# EAGLE design PR8002 (EAGLE 6.6.0)
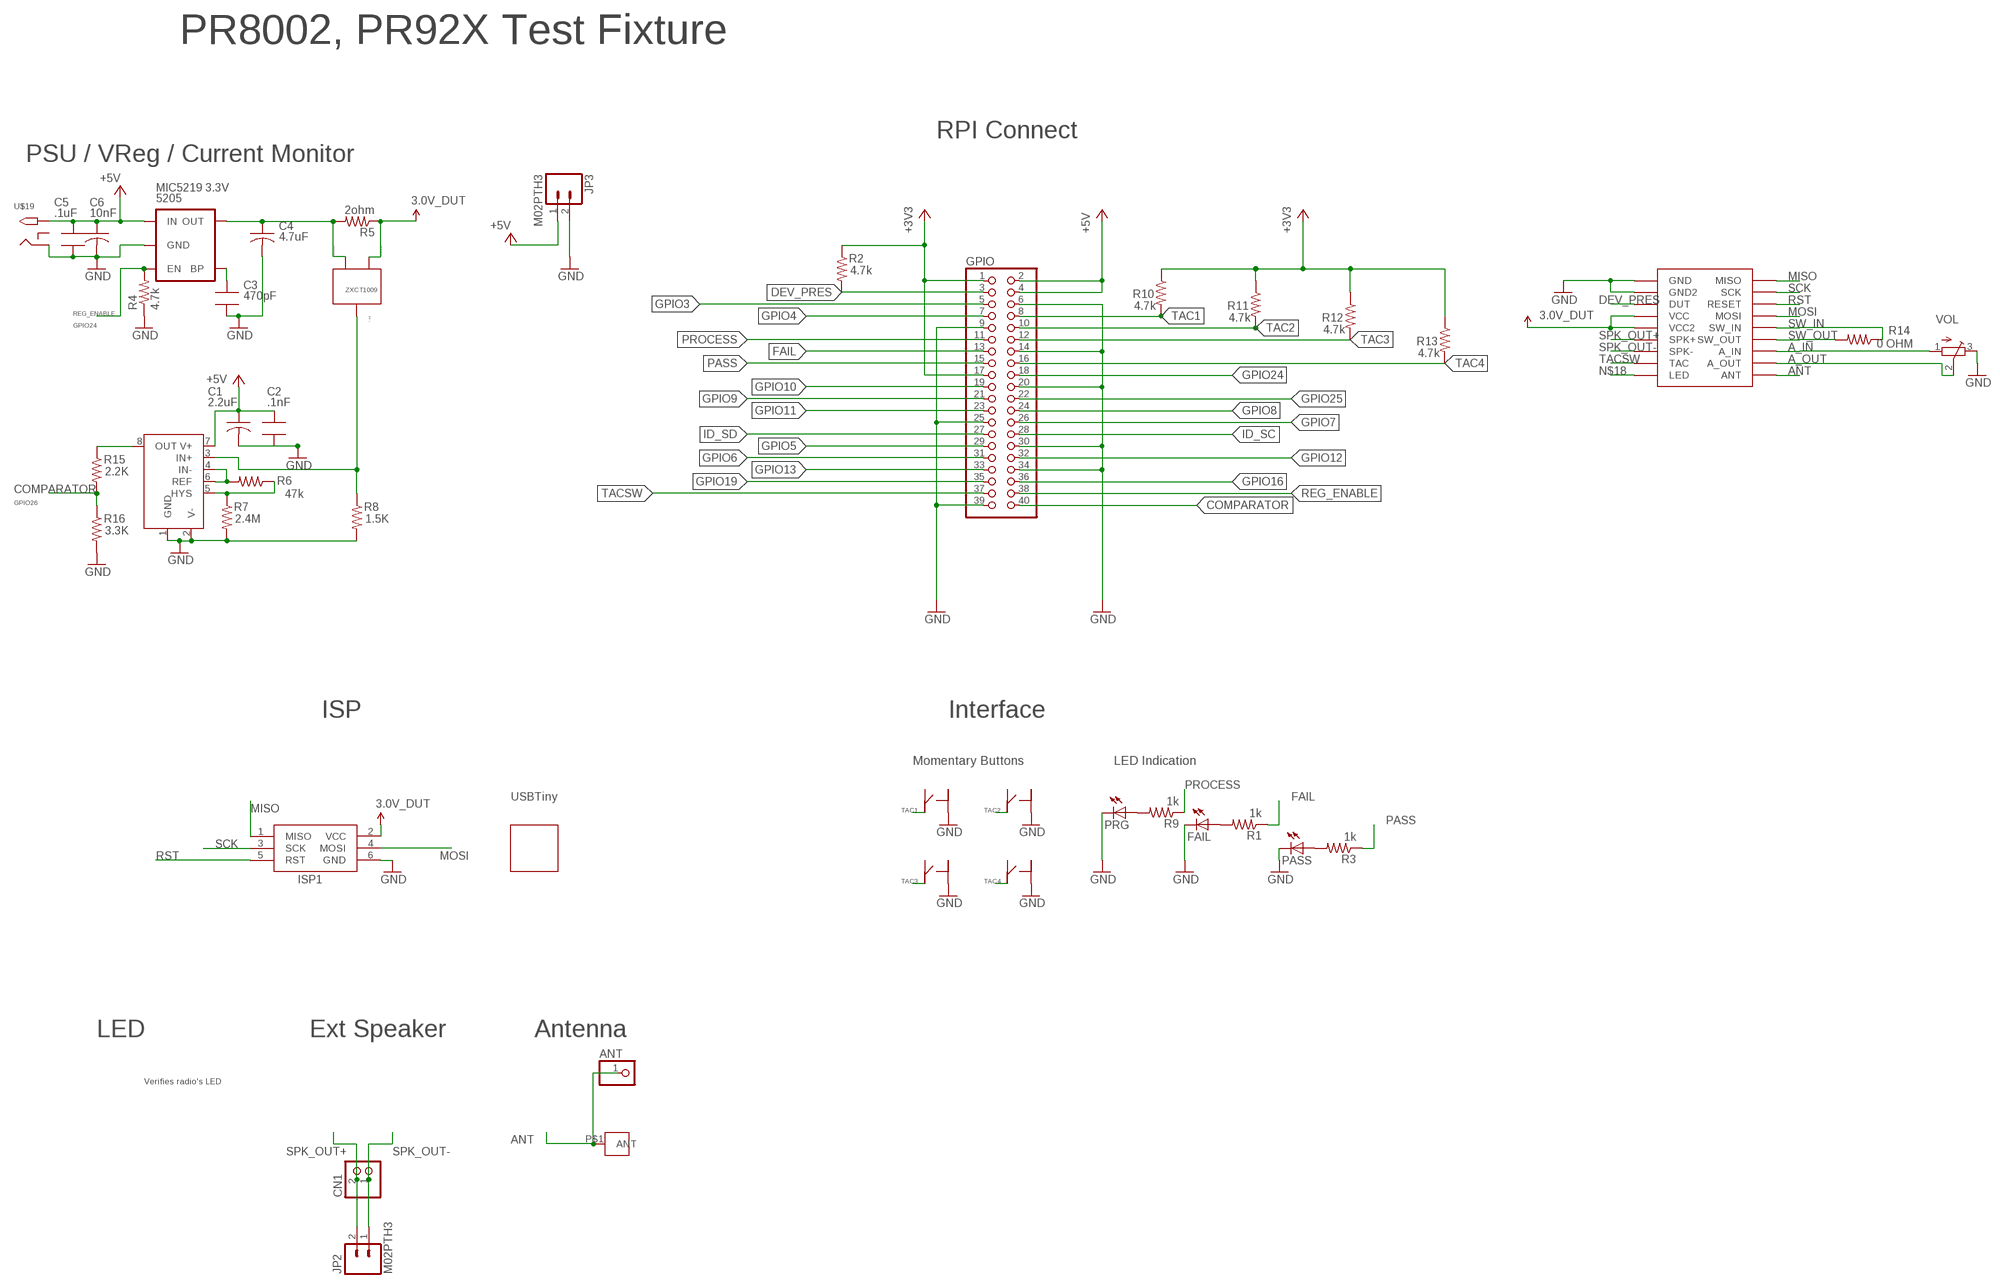
[diagram p0: schematic, sheet 1]

## Parts
5205  MIC5219 3.3V  V_REG_MIC52193.3V  [SOT23-5]
ANT  PINHD-1X1  [1X01]
C1  2.2uF  C-USC0805  [C0805]
C2  .1nF  C_SMT_0805_ADAFRUIT  [0805_ADAFRUIT]
C3  470pF  C_SMT_0805_ADAFRUIT  [0805_ADAFRUIT]
C4  4.7uF  C-USC0805  [C0805]
C5  .1uF  C_SMT_0805_ADAFRUIT  [0805_ADAFRUIT]
C6  10nF  C-USC0805  [C0805]
CN1  JST_2PIN-SMT-RA  [JST-B2B-PH-SM4-TB]
FAIL  LEDCHIP-LED0805  [CHIP-LED0805]
GPIO  PINHD-2X20  [2X20]
ISP1  AVRISP-6  [AVRISP]
J1  M3_SCREW_POST  [M3_BOLT_HOLE]
JP2  M02PTH3  [1X02_LONGPADS]
JP3  M02PTH3  [1X02_LONGPADS]
PASS  LEDCHIP-LED0805  [CHIP-LED0805]
PRG  LEDCHIP-LED0805  [CHIP-LED0805]
R1  1k  R_SMT_0805_ADAFRUIT  [0805_ADAFRUIT]
R2  4.7k  R_SMT_0805_ADAFRUIT  [0805_ADAFRUIT]
R3  1k  R_SMT_0805_ADAFRUIT  [0805_ADAFRUIT]
R4  4.7k  R_SMT_0805_ADAFRUIT  [0805_ADAFRUIT]
R5  2ohm  R_SMT_0805_ADAFRUIT  [0805_ADAFRUIT]
R6  47k  R_SMT_0805_ADAFRUIT  [0805_ADAFRUIT]
R7  2.4M  R_SMT_0805_ADAFRUIT  [0805_ADAFRUIT]
R8  1.5K  R_SMT_0805_ADAFRUIT  [0805_ADAFRUIT]
R9  1k  R_SMT_0805_ADAFRUIT  [0805_ADAFRUIT]
R10  4.7k  R_SMT_0805_ADAFRUIT  [0805_ADAFRUIT]
R11  4.7k  R_SMT_0805_ADAFRUIT  [0805_ADAFRUIT]
R12  4.7k  R_SMT_0805_ADAFRUIT  [0805_ADAFRUIT]
R13  4.7k  R_SMT_0805_ADAFRUIT  [0805_ADAFRUIT]
R14  0 OHM  R_SMT_0805_ADAFRUIT  [0805_ADAFRUIT]
R15  2.2K  R_SMT_0805_ADAFRUIT  [0805_ADAFRUIT]
R16  3.3K  R_SMT_0805_ADAFRUIT  [0805_ADAFRUIT]
TSM931  TSM931  [MSOP8]
U$19  2.1MMJACKTHM  [PJ-102A]
U$20  C&K_PTS645  [C&K_PTS645_SMT]
U$22  C&K_PTS645  [C&K_PTS645_SMT]
U$23  C&K_PTS645  [C&K_PTS645_SMT]
U$24  C&K_PTS645  [C&K_PTS645_SMT]
U$25  SFUN_POCKETPROGRAMMER  [SFUN_POCKETPROGRAMMER]
U$26  PR9020_TESTPOINTS  [PR9020_TESTPOINTS]
VOL  TRIMPOTTC33X  [TC33X]
ZXCT  ZXCT1009  [SOT23]

## Nets
3.3V: ISP1.2(VCC) R5.1 U$26.P$4(VCC) U$26.P$5(VCC2) ZXCT.1(VSENSE+) ; supply symbol labelled 3.0V_DUT
+3V3: GPIO.1 GPIO.17 R2.1 R10.1 R11.1 R12.1 R13.1
+5V: 5205.1(IN) C1.1 C2.1 C5.1 C6.1 GPIO.2 GPIO.4 JP3.1 TSM931.7(V+) U$19.TIP
A_IN: U$26.P$16(A_IN) VOL.1(A)
A_OUT: U$26.P$17(A_OUT) VOL.2(S)
ANT: ANT.1 J1.P$1(ANT) U$26.P$18(ANT)
COMPARATOR: GPIO.40 R15.2 R16.1
DEV_PRES: GPIO.3 R2.2 U$26.P$3(DUT)
FAIL: GPIO.13 R1.1
GND: 5205.2(GND) C1.2 C2.2 C3.2 C4.2 C5.2 C6.2 FAIL.C GPIO.6 GPIO.9 GPIO.14 GPIO.20 GPIO.25 GPIO.30 GPIO.34 GPIO.39 ISP1.6(GND) JP3.2 PASS.C PRG.C R4.1 R7.2 R8.2 R16.2 TSM931.1(GND) TSM931.2(V-) U$19.RING U$20.P$2 U$22.P$2 U$23.P$2 U$24.P$2 U$26.P$1(GND) U$26.P$2(GND2) VOL.3(E)
GPIO3: GPIO.5
GPIO4: GPIO.7
GPIO5: GPIO.29
GPIO6: GPIO.31
GPIO7: GPIO.26
GPIO8: GPIO.24
GPIO9: GPIO.21
GPIO10: GPIO.19
GPIO11: GPIO.23
GPIO12: GPIO.32
GPIO13: GPIO.33
GPIO16: GPIO.36
GPIO19: GPIO.35
GPIO24: GPIO.18
GPIO25: GPIO.22
ID_SC: GPIO.28
ID_SD: GPIO.27
MISO: ISP1.1(MISO) U$26.P$10(MISO)
MOSI: ISP1.4(MOSI) U$26.P$13(MOSI)
N$1: R6.2 TSM931.4(IN-) TSM931.6(REF)
N$2: PRG.A R9.2
N$3: FAIL.A R1.2
N$4: PASS.A R3.2
N$6: R15.1 TSM931.8(OUT)
N$12: R8.1 TSM931.3(IN+) ZXCT.3(IOUT)
N$13: 5205.4(BP) C3.1
N$14: 5205.5(OUT) C4.1 R5.2 ZXCT.2(VSENSE-)
N$15: R6.1 R7.1 TSM931.5(HYS)
N$18: U$26.P$9(LED)
PASS: GPIO.15 R3.1
PROCESS: GPIO.11 R9.1
REG_ENABLE: 5205.3(EN) GPIO.38 R4.2
RST: ISP1.5(RST) U$26.P$12(RESET)
SCK: ISP1.3(SCK) U$26.P$11(SCK)
SPK_OUT+: CN1.2 JP2.2 U$26.P$6(SPK+)
SPK_OUT-: CN1.1 JP2.1 U$26.P$7(SPK-)
SW_IN: R14.2 U$26.P$14(SW_IN)
SW_OUT: R14.1 U$26.P$15(SW_OUT)
TAC1: GPIO.8 R10.2 U$20.P$4
TAC2: GPIO.10 R11.2 U$23.P$4
TAC3: GPIO.12 R12.2 U$22.P$4
TAC4: GPIO.16 R13.2 U$24.P$4
TACSW: GPIO.37 U$26.P$8(TAC)
Unconnected: U$19.RING_SW U$20.P$1 U$20.P$3 U$22.P$1 U$22.P$3 U$23.P$1 U$23.P$3 U$24.P$1 U$24.P$3

## Notes on the sheet
- PR8002, PR92X Test Fixture
- RPI Connect
- PSU / VReg / Current Monitor
- ZXCT1009
- GPIO24
- GPIO26
- ISP | Interface
- Momentary Buttons | LED Indication
- USBTiny
- LED | Ext Speaker | Antenna
- Verifies radio's LED

## Library data of the parts
5205 = SparkFun-PowerIC:V_REG_MIC5219: V_REG MIC5219 Standard 3.3V and 5V 500mA LDO voltage regulator in SOT-23 layout. Micrel part MIC5219. BP (by-pass) pin is used to lower output noise with 470pF cap, may be left open.; PROD_ID: VREG-5205-3.0
ANT = adafruit:PINHD-1X1: Pin header 1x1 for 0.1" spacing With round pins
C1 C4 C6 = adafruit:C-US: CAPACITOR, American symbol
C2 C3 C5 = PR_Parts_Library:C_SMT: SMT capacitor
CN1 = PR_Parts_Library:JST_2PIN: JST 2-pin connector; MFG_PN: B2B-PH-SM4-TB(LF)(SN)
FAIL PASS PRG = adafruit:LED: LED OSRAM: - CHIPLED LG R971, LG N971, LY N971, LG Q971, LY Q971, LO R971, LY R971 LH N974, LH R974 LS Q976, LO Q976, LY Q976 LO Q996 - Hyper CHIPLED LW Q18S LB Q993, LB Q99A, LB R99A - SideLED LS A670, LO A670, LY A670, LG A670, LP A670 LB A673, LV A673, LT A673, LW A673 LH A674 LY A675 LS A676, LA A676, LO A676, LY A676, LW A676 LS A679, LY A679, LG A679 - Hyper Micro SIDELED® LS Y876, LA Y876, LO Y876, LY Y876 LT Y87S - SmartLED LW L88C, LW L88S LB L89C, LB L89S, LG L890 LS L89K, LO L89K, LY L89K LS L896, LA L896, LO L896, LY L896 - TOPLED LS T670, LO T670, LY T670, LG T670, LP T670 LSG T670, LSP T670, LSY T670, LOP T670, LYG T670 LG T671, LOG T671, LSG T671 LB T673, LV T673, LT T673, LW T673 LH T674 LS T676, LA T676, LO T676, LY T676, LB T676, LH T676, LSB T676, LW T676 LB T67C, LV T67C, LT T67C, LS T67K, LO T67K, LY T67K, LW E67C LS E67B, LA E67B, LO E67B, LY E67B, LB E67C, LV E67C, LT E67C LW T67C LS T679, LY T679, LG T679 LS T770, LO T770, LY T770, LG T770, LP T770 LB T773, LV T773, LT T773, LW T773 LH T774 LS E675, LA E675, LY E675, LS T675 LS T776, LA T776, LO T776, LY T776, LB T776 LHGB T686 LT T68C, LB T68C - Hyper Mini TOPLED® LB M676 - Mini TOPLED Santana® LG M470 LS M47K, LO M47K, LY M47K Source: http://www.osram.convergy.de/
GPIO = pinhead:PINHD-2X20: PIN HEADER
ISP1 = adafruit:AVRISP: AVR ISP HEADER Standard 6 pin header for AVR programming
J1 = PR_Parts_Library:M3_SCREW_POST: Antenna mounting hole for M3 screw.; MFG_PN: DNP
JP2 JP3 = SparkFun-Connectors:M02: Standard 2-pin 0.1" header. Use with - straight break away headers ( PRT-00116) - right angle break away headers (PRT-00553) - swiss pins (PRT-00743) - machine pins (PRT-00117) - female headers (PRT-00115) Molex polarized connector foot print use with: PRT-08233 with associated crimp pins and housings. 2.54_SCREWTERM for use with PRT-10571. 3.5mm Screw Terminal footprints for PRT-08084 5mm Screw Terminal footprints for use with PRT-08432
R1-R4 R6 R7 R9-R16 = PR_Parts_Library:R_SMT: SMT resistor
R5 = PR_Parts_Library:R_SMT: SMT resistor; POWER: .5W; TOL: 1%
R8 = PR_Parts_Library:R_SMT: SMT resistor; TOL: 1%
TSM931 = PR_Parts_Library:TSM931
U$19 = adafruit:2.1MMJACK: 2.1mm x 5.5mm THM DC jack with internal switch. Digikey part #PJ-102A, 4UCON part #05537 2.1mm x 5.5mm SMT DC jack with internal switch. Digikey part #PJ-002A-SMT, 4UCON part #03267 By microbuilder.eu & adafruit.com
U$20 U$22-U$24 = PR_Parts_Library:C&K_PTS645: SWITCH TACTILE SPST-NO 0.05A 12V; MFG_PN: PTS645SM43SMTR92 LFS
U$25 = PR_Parts_Library:SFUN_POCKETPROGRAMMER
U$26 = PR_Parts_Library:PR9020_TESTPOINTS
VOL = adafruit:TRIMPOT: SMT trimmer potentiometer part number TC33X http://www.ladyada.net/library/eagle
ZXCT = PR_Parts_Library:ZXCT1009

## Net classes
1 antenna: clearance 1.27 mm

## Board
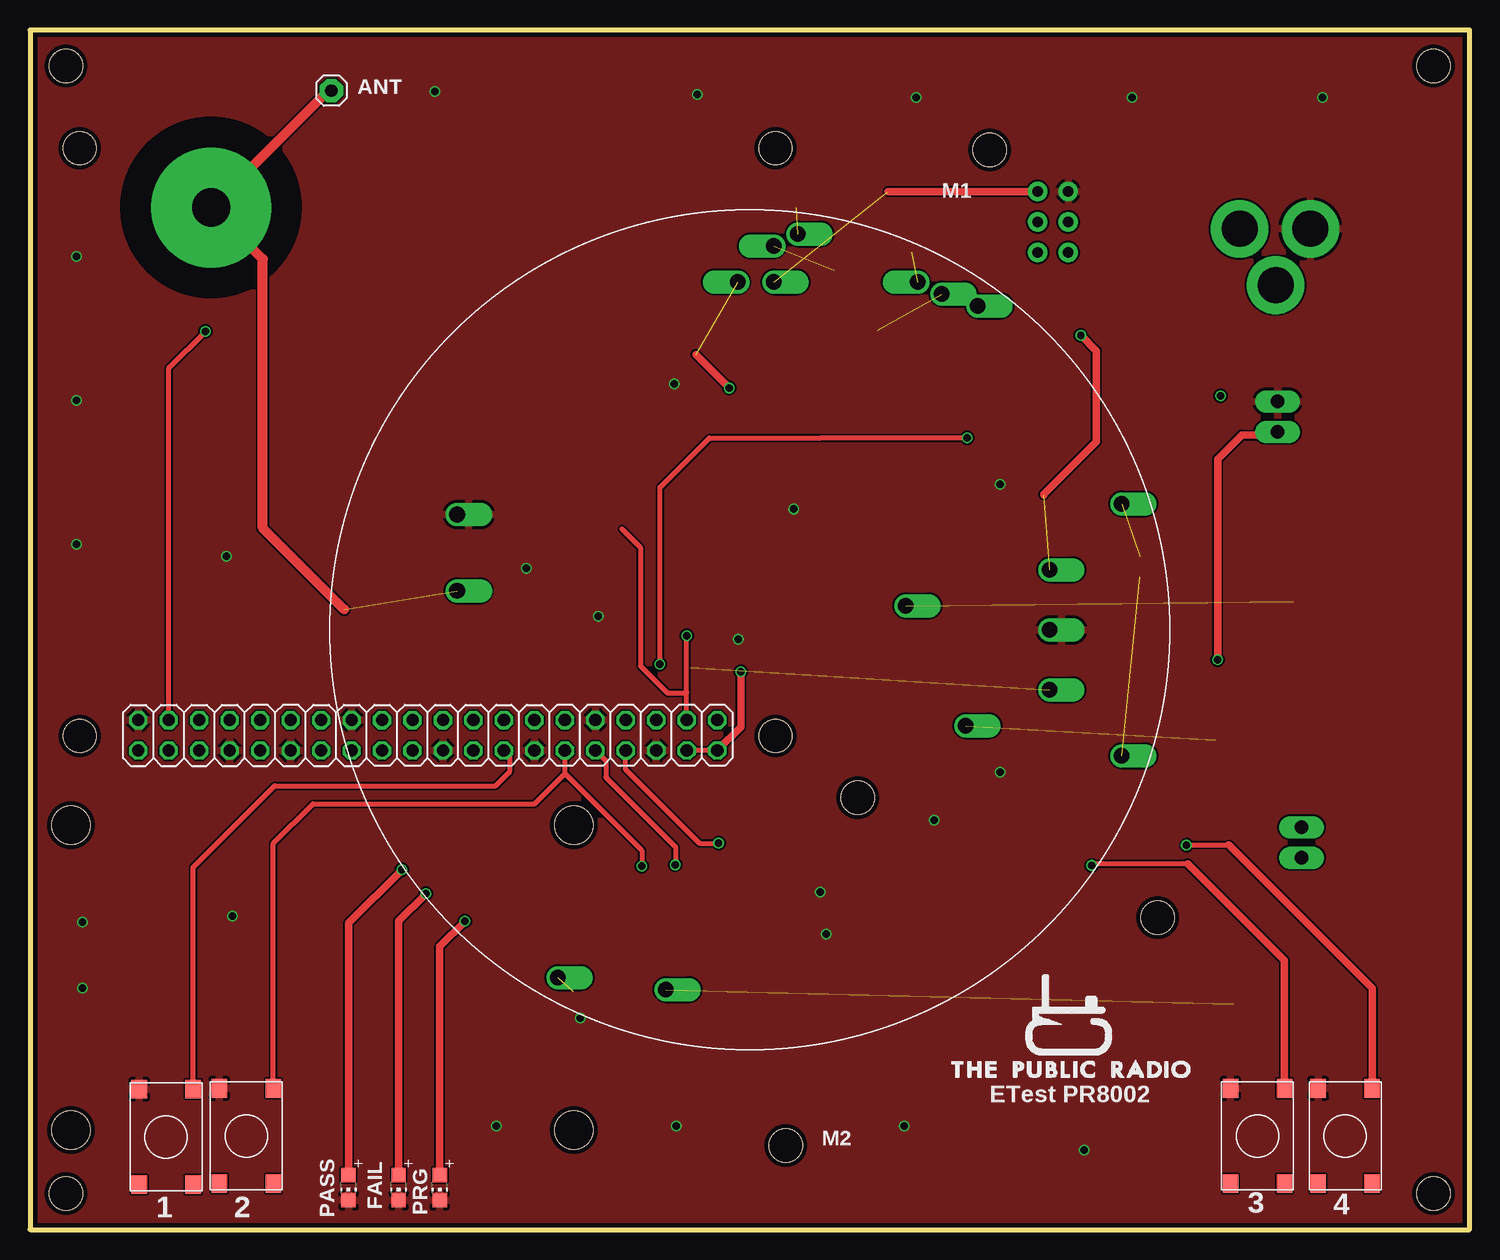
[diagram p1: board, top side]
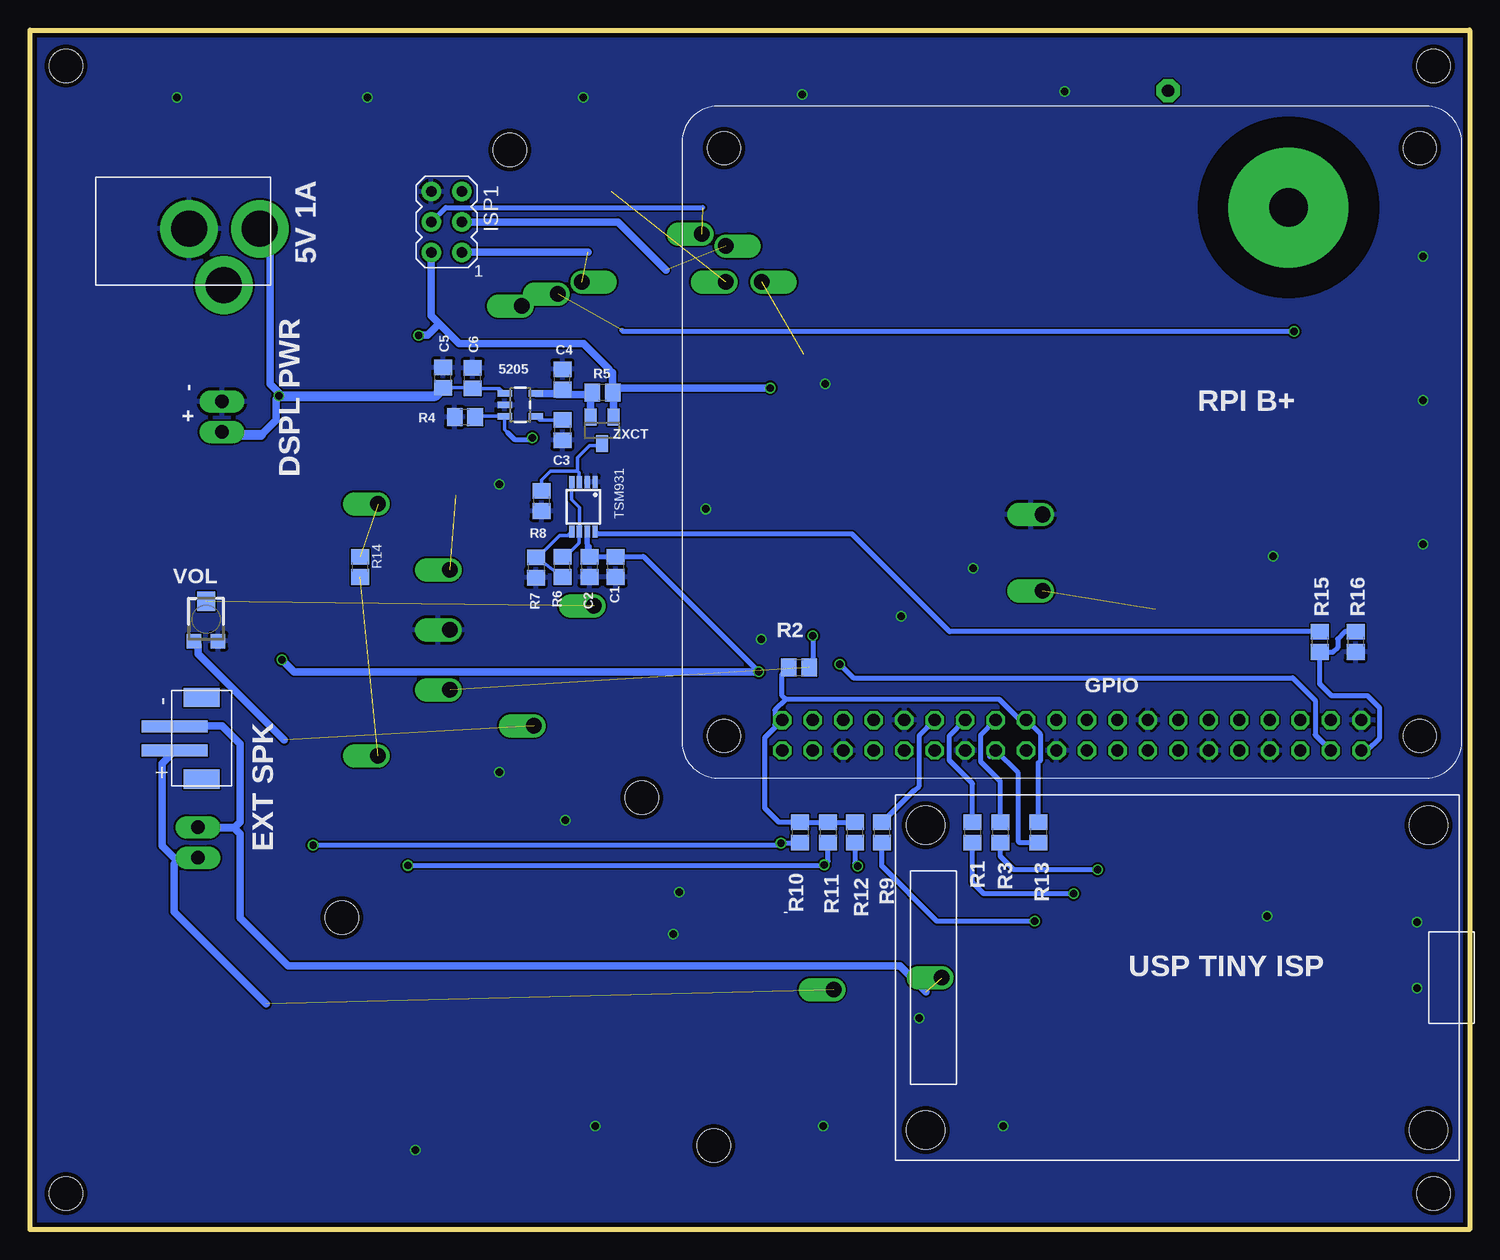
[diagram p2: board, bottom side, seen from below]

Size 120 x 100 mm. Coordinates in mm from the lower left corner, seen from the top.
Outline: 0,0 120,0 120,100 0,100 0,0
Copper layers (1*16): Top 0.0356mm / dielectric 1.5011mm / Bottom 0.0356mm
Design rules "LaenPCBOrder *": minimum track width 6mil, minimum drill 13mil, track to track 6mil, track to pad 6mil, pad to pad 6mil, via to via 6mil, smd to smd 6mil, copper to edge 15mil, drill to drill 6mil, minimum pad ring 7mil, minimum via ring 5mil, stop-mask expansion 3mil, vias tented up to drill 0mil, thermal gap 10mil
Holes 2.75 mm at 62.15,90.15 62.15,41.15 4.15,90.15 4.15,41.15 63,7 80,90 3,3 3,97 117,97 69,36 117,3 94,26

### Footprints (pad centres in the part's own frame; a part is rotated, then mirrored left to right if it is on the bottom)
SOT23-5 = smd 0.55 x 1.2: 1 -0.95,-1.3; 2 0,-1.3; 3 0.95,-1.3; 4 0.95,1.3; 5 -0.95,1.3
1X01 = drill 1.016 pad 1.93 octagon: 1 0,0
C0805 = smd 1.3 x 1.5: 1 -0.85,0; 2 0.85,0
0805_ADAFRUIT = smd 1.3 x 1.5: 1 -0.85,0; 2 0.85,0
JST-B2B-PH-SM4-TB = smd 1 x 5.5: 1 1,-2.75; 2 -1,-2.75 | smd 1.6 x 3: NC1 -3.4,-0.5; NC2 3.4,-0.5
CHIP-LED0805 = smd 1.2 x 1.2: A 0,-1.05; C 0,1.05
2X20 = drill 1.016 octagon: 1 -24.13,-1.27; 2 -24.13,1.27; 3 -21.59,-1.27; 4 -21.59,1.27; 5 -19.05,-1.27; 6 -19.05,1.27; 7 -16.51,-1.27; 8 -16.51,1.27; 9 -13.97,-1.27; 10 -13.97,1.27; 11 -11.43,-1.27; 12 -11.43,1.27; 13 -8.89,-1.27; 14 -8.89,1.27; 15 -6.35,-1.27; 16 -6.35,1.27; 17 -3.81,-1.27; 18 -3.81,1.27; 19 -1.27,-1.27; 20 -1.27,1.27; 21 1.27,-1.27; 22 1.27,1.27; 23 3.81,-1.27; 24 3.81,1.27; 25 6.35,-1.27; 26 6.35,1.27; 27 8.89,-1.27; 28 8.89,1.27; 29 11.43,-1.27; 30 11.43,1.27; 31 13.97,-1.27; 32 13.97,1.27; 33 16.51,-1.27; 34 16.51,1.27; 35 19.05,-1.27; 36 19.05,1.27; 37 21.59,-1.27; 38 21.59,1.27; 39 24.13,-1.27; 40 24.13,1.27
AVRISP = drill 0.9 pad 1.626: 1 -1.27,2.54; 2 1.27,2.54; 3 -1.27,0; 4 1.27,0; 5 -1.27,-2.54; 6 1.27,-2.54
M3_BOLT_HOLE = drill 3.2 pad 10: P$1 0,0
1X02_LONGPADS = drill 1.118 pad 1.88 long: 1 0,0; 2 2.54,0
MSOP8 = smd 0.45 x 1: 1 -0.975,-2.05; 2 -0.325,-2.05; 3 0.325,-2.05; 4 0.975,-2.05; 5 0.975,2.05; 6 0.325,2.05; 7 -0.325,2.05; 8 -0.975,2.05
PJ-102A = drill 3 pad 4.8: RING 0.1,-3.39; RING_SW -4.6,-6.29; TIP 0.1,-9.29
C&K_PTS645_SMT = smd 1.55 x 1.3: P$1 -3.975,2.25; P$2 3.975,2.25; P$3 -3.975,-2.25; P$4 3.975,-2.25
SFUN_POCKETPROGRAMMER = hole 3.2: -12.7,20.32; 12.7,20.32; -12.7,-21.59; 12.7,-21.59
PR9020_TESTPOINTS = drill 1.3 pad 1.3 offset: P$1 10.6,44.6; P$2 60,35; P$3 60,30; P$4 60,40; P$5 34,64; P$6 19,6; P$7 28,5; P$8 51,63; P$9 54,62; P$10 49,64; P$11 37,67; P$12 37,64; P$13 39,68; P$14 66,24.5; P$15 66,45.5; P$16 53,27; P$17 48,37; P$18 10.6,38.25
TC33X = smd 1.2 x 1.2: 1 -1,-1.825; 3 1,-1.825 | smd 1.5 x 1.6: 2 0,1.5
SOT23 = smd 1 x 1.4: 1 -0.95,-1.1; 2 0.95,-1.1; 3 0,1.1

### Placement (x,y rotation side)
5205  79.12,68.75 270 bottom
ANT  25.12,94.95 0 top
C1  71.17,55.25 270 bottom
C2  73.38,55.25 270 bottom
C3  75.62,66.65 270 bottom
C4  75.62,70.88 90 bottom
C5  85.55,71.03 90 bottom
C6  83.1,70.97 90 bottom
CN1  105.17,40.95 270 bottom
FAIL  30.73,3.5 180 top
GPIO  33.16,41.2 180 top
ISP1  85.28,84 180 bottom
J1  15.1,85.2 0 top
JP2  106,31 90 top
JP3  104,66.5 90 top
PASS  26.55,3.5 180 top
PRG  34.15,3.5 180 top
R1  41.42,33.1 270 bottom
R2  55.9,46.85 0 bottom
R3  39.12,33.1 270 bottom
R4  83.75,67.75 0 bottom
R5  72.28,69.78 180 bottom
R6  75.62,55.25 90 bottom
R7  77.83,55.2 270 bottom
R8  77.38,60.75 270 bottom
R9  49,33.1 270 bottom
R10  55.8,33.1 270 bottom
R11  53.48,33.1 270 bottom
R12  51.25,33.1 270 bottom
R13  35.95,33.1 270 bottom
R14  92.5,55.25 270 bottom
R15  12.5,49 270 bottom
R16  9.5,49 270 bottom
TSM931  73.88,60.25 180 bottom
U$1  [PR_LOGO]  86.58,18.23 0 top
U$19  110.12,83.33 90 bottom
U$20  109.62,7.8 90 top
U$22  18.02,7.8 90 top
U$23  102.33,7.8 90 top
U$24  11.35,7.72 90 top
U$25  25,21 90 bottom
U$26  25,15 0 top
VOL  105.33,50.88 0 bottom
ZXCT  72.33,66.62 180 bottom

### Tracks (layer width: path | path; a pad name or v marks a point on that pad's centre or on a via)
3.3V  (via drill 0.6 pad 0.61)  (2 unrouted)
  Top 0.61: 55.5,72.95 v58.3,70.15 | 84.5,61.25 84.5,61.3 88.9,65.7 88.9,73.25 v87.6,74.55
  Bottom 0.305: 71.67,69.53 R5.1 | 71.42,71.42 71.75,71.75
  Bottom 0.406: R5.1 71.12,69.62 | 71.75,69.65 R5.1 | 71.05,70.15 R5.1
  Bottom 0.61: ISP1.2 86.55,76.17 85.89,75.51 | 85.89,75.51 84.25,73.88 73.88,73.88 71.75,71.75 | 71.42,71.42 R5.1 71.38,69.72 ZXCT.1 | v87.6,74.55 86.85,74.55 85.89,75.51 | v58.3,70.15 71.05,70.15
+3V3
  Bottom 0.406: 57,44.2 39.2,44.2 37.47,42.47 GPIO.17 35.75,41.26 35.75,39.12 35.95,38.92 R13.1 | 57,44.2 57.9,43.3 57.9,42.09 GPIO.1 58.75,41.01 58.75,35.12 57.58,33.95 R10.1 R11.1 R12.1 | 57,44.2 57.3,44.5 57.3,46.3 R2.1
+5V  (via drill 0.6 pad 0.61)
  Top 0.406: GPIO.2 GPIO.4
  Top 0.61: v99,47.5 99,64.25 101,66.25 103.75,66.25 JP3.1 | GPIO.2 59.25,41.9 v59.25,46.5
  Bottom 0.305: 73.38,56.98 73.55,57.15 | C2.1 C1.1 | C5.1 83.15,70.17 C6.1 80.85,70.12 5205.1
  Bottom 0.406: C2.1 73.38,56.12 | 73.38,56.12 73.38,56.98 | 73.55,57.15 TSM931.7 73.55,56.3 73.38,56.12 | 73.38,56.12 68.88,56.12 v59.25,46.5
  Bottom 0.61: 100.75,66.25 99.5,67.5 99.5,69.25 v99.25,69.5 99.25,69.75 100,70.5 100,82.59 U$19.TIP | v99,47.5 98,46.5 v59.25,46.5 | 70.83,55.75 C1.1
  Bottom 0.813: C5.1 86.22,69.5 v99.25,69.5 | 100.75,66.25 103.75,66.25 JP3.1
A_IN  (1 unrouted)
  Bottom 0.61: 98.8,40.8 106,48 106,48.73 VOL.1
A_OUT  (1 unrouted)
ANT  (1 unrouted)
  Top 0.813: 26.2,51.7 19.4,58.5 19.4,80.9 J1.P$1 24.85,94.95 ANT.1
COMPARATOR
  Bottom 0.406: GPIO.40 8.57,39.93 7.5,41 7.5,43.5 8.5,44.5 11.5,44.5 12.5,45.5 R15.2 11.35,48.15 11,48.5 11,49.25 10.4,49.85 R16.1
DEV_PRES  (via drill 0.6 pad 0.61)  (1 unrouted)
  Top 0.406: GPIO.3 54.74,44.75 | 54.74,44.75 v54.74,49.49 v54.75,49.5 | 49.35,58.4 50.88,56.88 50.88,47 53.12,44.75 54.74,44.75
  Bottom 0.406: v54.75,49.5 54.75,47.15 R2.2
FAIL
  Bottom 0.305: R1.1 41.42,34.42
  Bottom 0.406: 41.42,34.42 41.42,37.17 43.38,39.12 43.38,41.14 GPIO.13
GND  (via drill 0.6)
  other vias: 59.05,49.2 63.67,60.08 53.7,70.5 4.38,25.62 91.88,94.38 107.75,94.38 66.38,24.62 65.88,28.12 80.88,38.12 75.38,34.12 80.88,62.12 33.75,94.88 55.62,94.62 73.88,94.38 3.88,81.12 3.88,69.12 3.88,57.12 4.38,20.12 38.88,8.62 53.88,8.62 72.88,8.62 87.88,6.62 47.38,51.12 41.38,55.12 16.38,56.12 16.88,26.12 45.88,17.62
  pour Top: 0,100 120,100 120,0 0,0
  pour Bottom: 0,0 120,0 120,100 0,100
MISO  (1 unrouted)
  Bottom 0.61: 73.5,81.5 83.97,81.5 ISP1.1
MOSI  (1 unrouted)
  Bottom 0.406: ISP1.4 85.35,85.2 63.9,85.2
N$1
  Bottom 0.305: TSM931.4 74.88,62.27 74.88,60.88 74.2,60.2 TSM931.6 74.25,58.15 74.25,57.25 75.38,56.12 R6.2
N$2  (via drill 0.6 pad 0.61)
  Top 0.61: PRG.A 34.15,23.6 v36.25,25.7
  Bottom 0.406: v36.25,25.7 44.4,25.7 49,30.3 R9.2
N$3  (via drill 0.6 pad 0.61)
  Top 0.61: FAIL.A 30.73,25.73 v33,28
  Bottom 0.406: v33,28 40.5,28 41.42,28.93 R1.2
N$4  (via drill 0.6 pad 0.61)
  Top 0.61: PASS.A 26.55,25.55 v31,30
  Bottom 0.406: v31,30 38,30 39.12,31.12 R3.2
N$6
  Bottom 0.406: R15.1 43.35,49.85 51.5,58 72.7,58 TSM931.8
N$12
  Bottom 0.305: 77.53,61.75 R8.1 77.38,62.5 76.62,63.25 74.38,63.25 | 74.38,63.25 74.25,63.12 74.25,62.35 TSM931.3 | 74.38,63.25 74.38,64.38 73.38,65.38 72.78,65.38 ZXCT.3
N$13
  Bottom 0.305: 77.53,67.85 5205.4 77.53,67.5 C3.1
N$14
  Bottom 0.305: 75.22,69.62 C4.1 75.95,69.7
  Bottom 0.61: 5205.5 76.12,69.7 | 76.12,69.7 75.95,69.7 | 73.28,69.62 76.05,69.62 76.12,69.7 | ZXCT.2 73.28,69.62 | 73.28,69.62 R5.2
N$15
  Bottom 0.305: TSM931.5 75.17,57.88 75.88,57.88 77.38,56.38 R7.1 R6.1
N$21
  pour Bottom: 
PASS
  Bottom 0.305: R3.1 39.12,34.62
  Bottom 0.406: 39.12,34.62 39.12,37.38 40.75,39 40.75,41.23 GPIO.15
PROCESS
  Bottom 0.406: R9.1 46.38,36.58 46.3,36.58 45.88,37 45.88,41.18 GPIO.11 45.09,41.91
REG_ENABLE  (via drill 0.6, 0.6 pad 0.61)
  Top 0.406: v78.12,66 66.62,66 65.9,66 56.62,66 52.5,61.88 v52.5,47.12
  Bottom 0.305: 82.85,67.8 5205.3 80.42,66.67 80.17,66.42
  Bottom 0.406: 82.85,67.8 R4.2 | 80.17,66.42 79.62,65.88 78.25,65.88 v78.12,66 | GPIO.38 12.88,41.24 12.88,44.12 14.75,46 51.38,46 v52.5,47.12
RST  (1 unrouted)
  Top 0.61: ISP1.5 71.54,86.54
SCK  (1 unrouted)
  Bottom 0.61: ISP1.3 71,84 67,80
SPK_OUT+  (1 unrouted)
  Bottom 0.61: 45.3,19.8 47.5,22 98.5,22 102.5,26 102.5,33 103,33.5 | CN1.2 107.88,42 104,42 102.5,40.5 102.5,34 103,33.5 | 103,33.5 103.04,33.54 JP2.2 105.96,33.5 103,33.5
SPK_OUT-  (1 unrouted)
  Bottom 0.406: JP2.1 107.5,31 108,31
  Bottom 0.61: 100.3,18.8 108,26.5 108,30.5 107.5,31 | 108,39.88 CN1.1 109,38.88 109,32 108,31
SW_IN  (1 unrouted)
SW_OUT  (1 unrouted)
TAC1  (via drill 0.6 pad 0.61)
  Top 0.406: v96.4,32.05 99.95,32.05 | v57.4,32.2 55.8,32.2 49.66,38.34 GPIO.8
  Top 0.61: 99.95,32.05 111.88,20.12 U$20.P$4
  Bottom 0.406: v96.4,32.05 57.55,32.05 v57.4,32.2 57.35,32.25 R10.2
TAC2  (via drill 0.6 pad 0.61)
  Top 0.406: GPIO.10 48,39.05 48,37.7 53.8,31.9 v53.8,30.4 | 96.5,30.5 88.65,30.5 v88.5,30.35
  Top 0.61: 96.5,30.5 104.58,22.43 U$23.P$4
  Bottom 0.406: v53.8,30.4 53.7,30.3 53.8,30.3 | v88.5,30.35 53.85,30.35 v53.8,30.4 | v53.8,30.4 53.48,30.73 R11.2
TAC3  (via drill 0.6 pad 0.61)
  Top 0.406: v51,30.3 51,31.6 44.59,38.02 | U$22.P$4 20.27,32.17 23.6,35.5 42.07,35.5 44.59,38.02 | 44.59,38.02 GPIO.12
  Bottom 0.406: 50.9,30.2 v51,30.3 51.25,30.55 R12.2
TAC4
  Top 0.406: GPIO.16 40,39.42 40,38.2 38.8,37 20.4,37 13.6,30.2 U$24.P$4
  Bottom 0.406: 40,39.42 GPIO.16 37.62,38.05 37.62,32.38 37.5,32.25 R13.2
TACSW  (via drill 0.6 pad 0.61)  (1 unrouted)
  Top 0.406: GPIO.37 11.56,71.81 v14.62,74.88
  Bottom 0.406: 70.66,74.96 70.58,74.88 v14.62,74.88

### Text on the board
tPlace: M1 | M2 | 1 | 2 | 3 | 4
bPlace: + - | EXT SPK
tNames: ETest PR8002
bNames: 5V 1A | RPI B+ | DSPL PWR | USP TINY ISP